# EAGLE design rf_board (EAGLE 7.2.0)
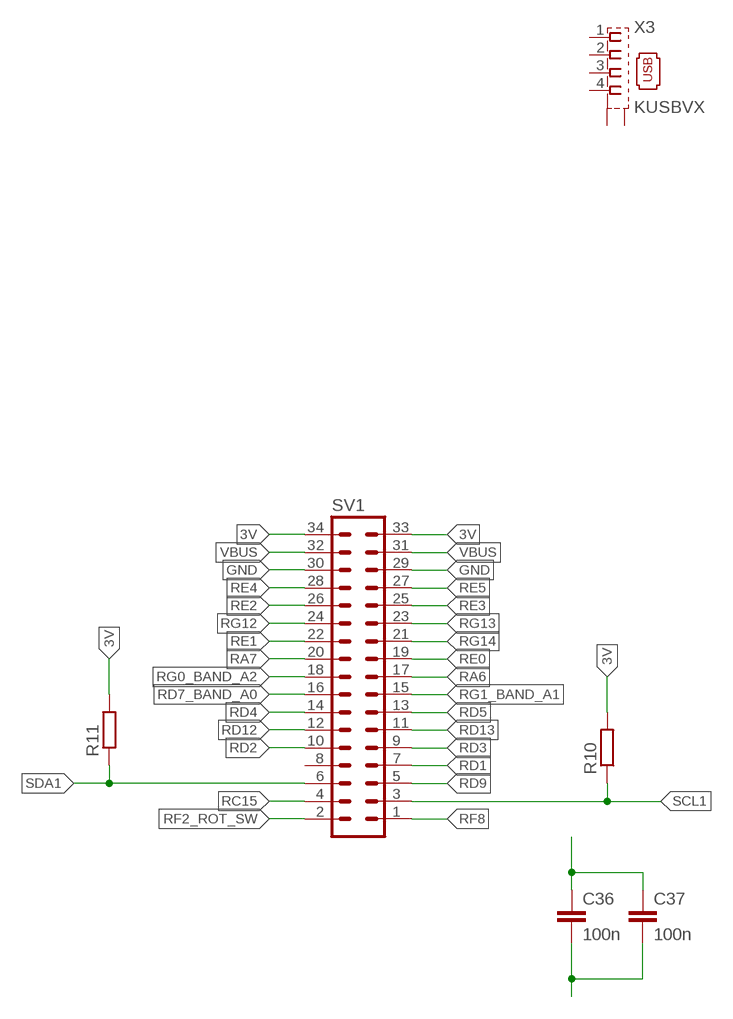
[diagram p0: schematic, sheet 1, part 1 of 2]
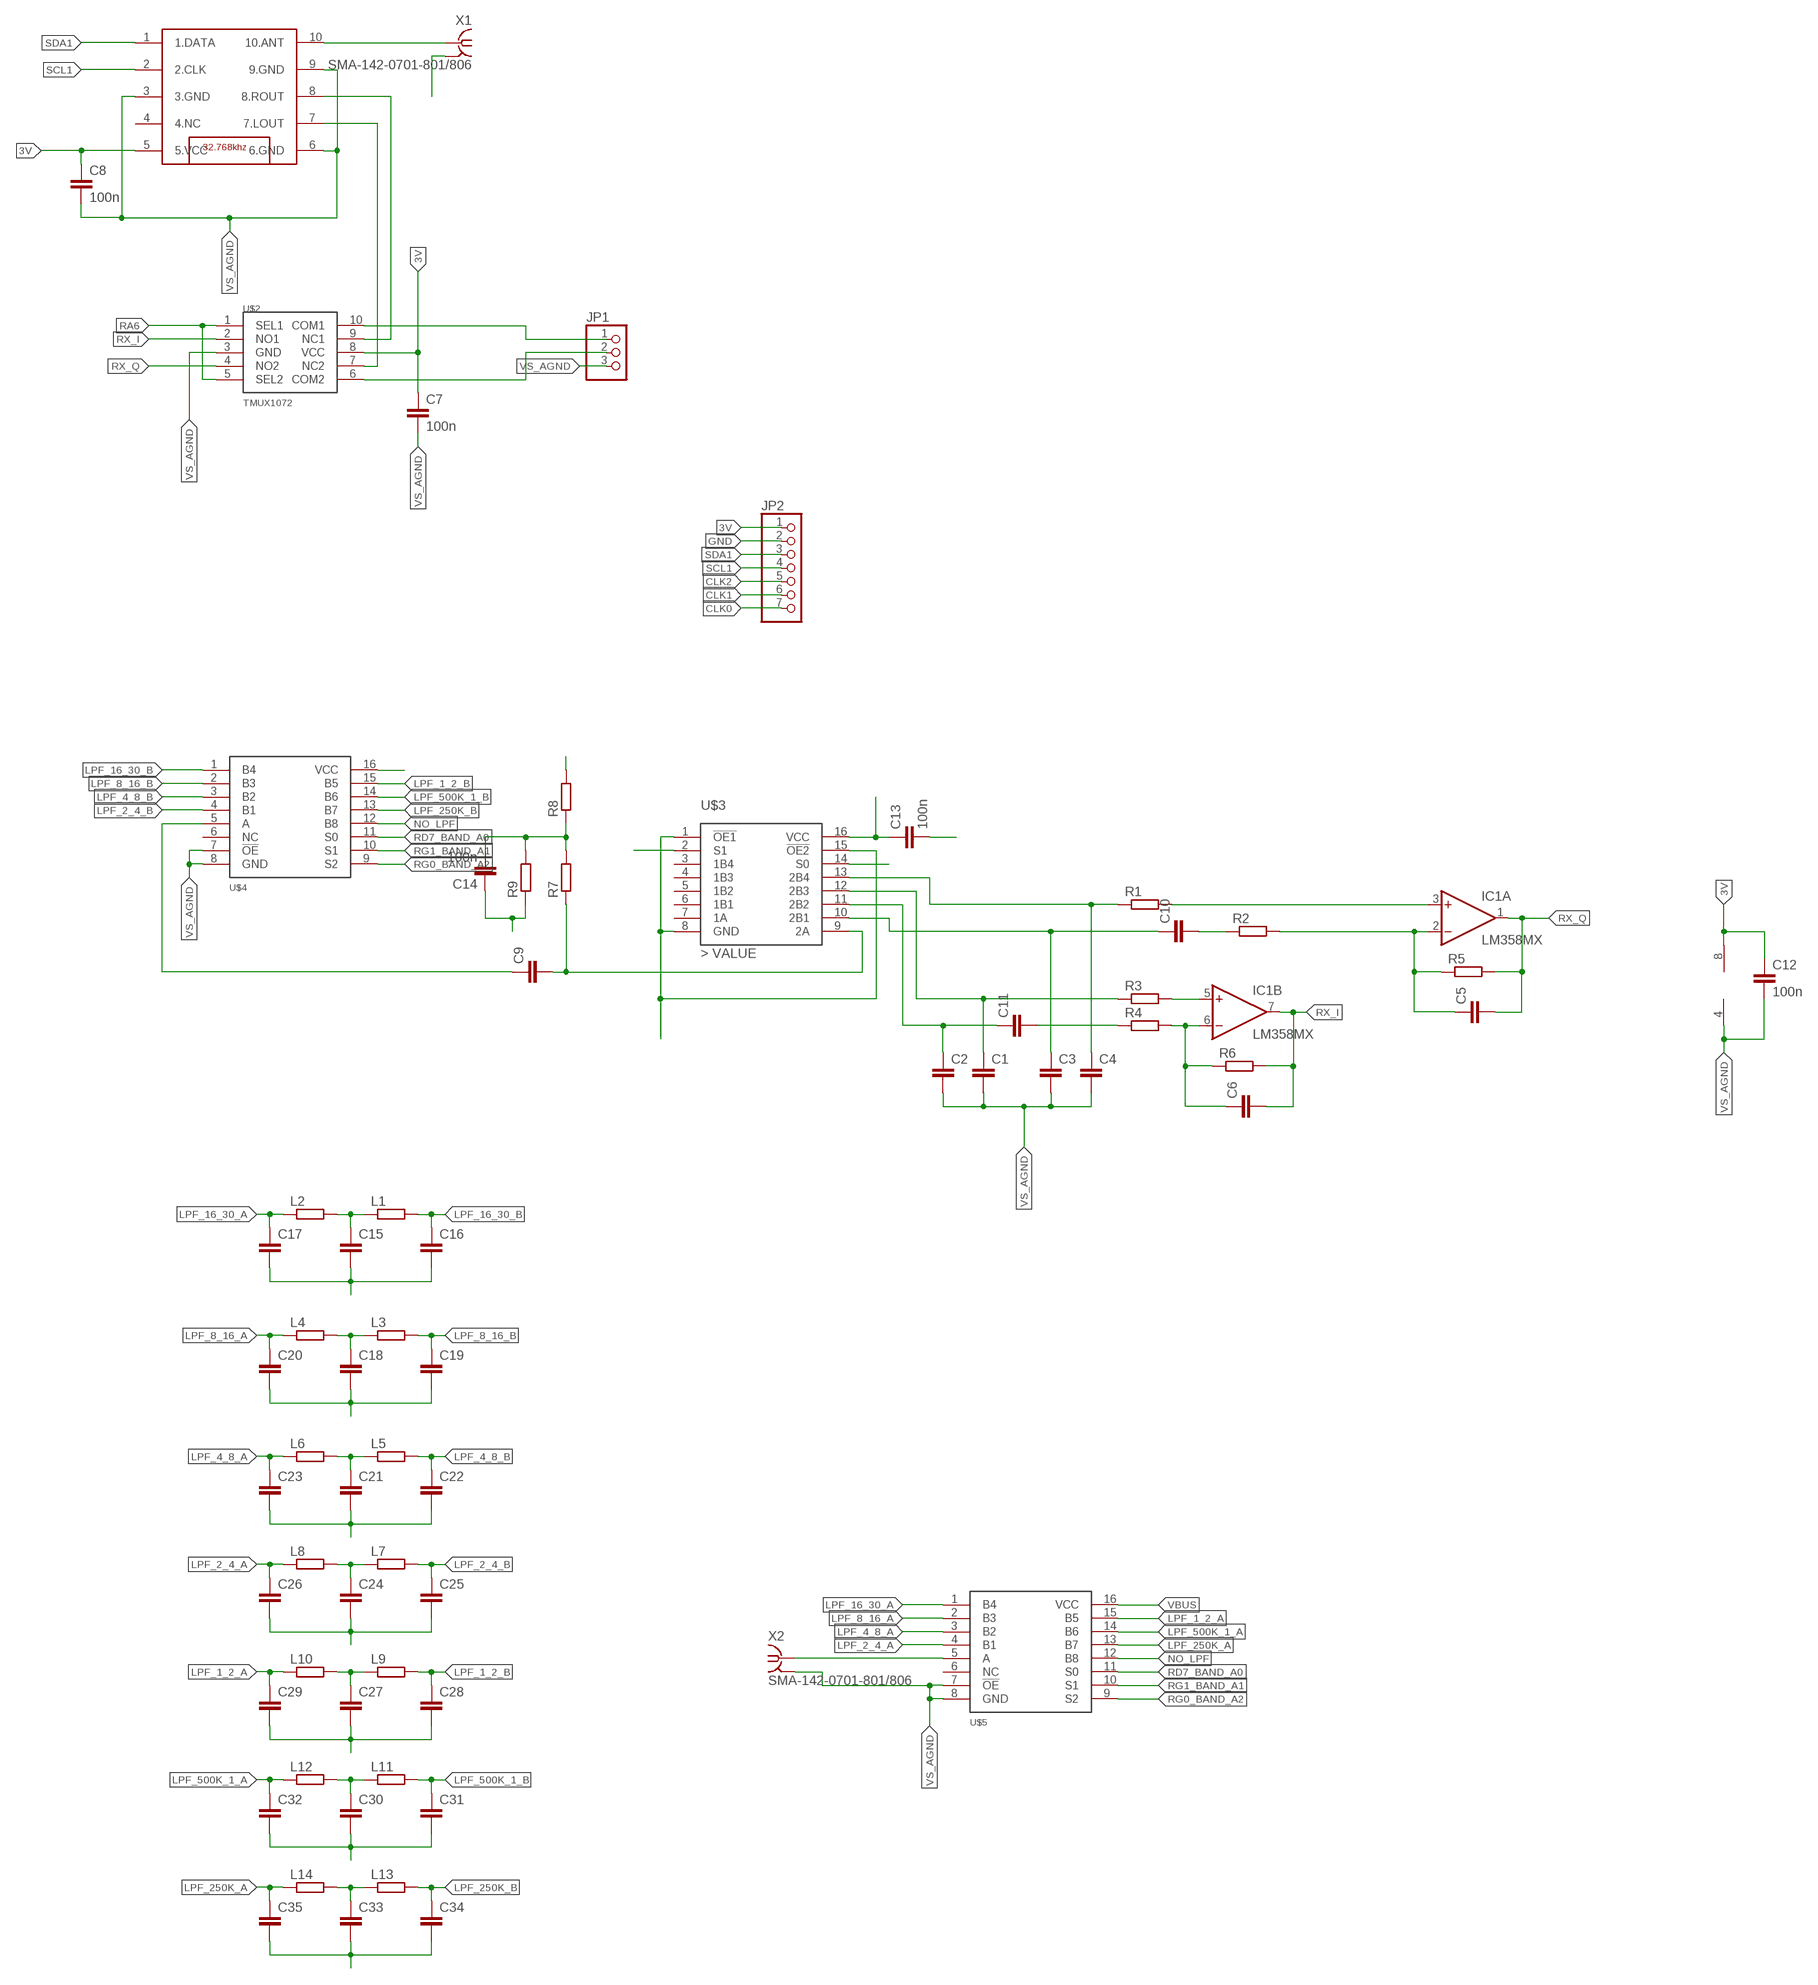
[diagram p1: schematic, sheet 1, part 2 of 2]

## Parts
C1  C-EUC0603  [C0603]
C2  C-EUC0603  [C0603]
C3  C-EUC0603  [C0603]
C4  C-EUC0603  [C0603]
C5  C-EUC0603  [C0603]
C6  C-EUC0603  [C0603]
C7  100n  C-EUC1206  [C1206]
C8  100n  C-EUC0603  [C0603]
C9  C-EUC0603  [C0603]
C10  C-EUC0603  [C0603]
C11  C-EUC0603  [C0603]
C12  100n  C-EUC0603  [C0603]
C13  100n  C-EUC0603  [C0603]
C14  100n  C-EUC0603  [C0603]
C15  C-EUC0805  [C0805]
C16  C-EUC0805  [C0805]
C17  C-EUC0805  [C0805]
C18  C-EUC0805  [C0805]
C19  C-EUC0805  [C0805]
C20  C-EUC0805  [C0805]
C21  C-EUC0805  [C0805]
C22  C-EUC0805  [C0805]
C23  C-EUC0805  [C0805]
C24  C-EUC0805  [C0805]
C25  C-EUC0805  [C0805]
C26  C-EUC0805  [C0805]
C27  C-EUC0805  [C0805]
C28  C-EUC0805  [C0805]
C29  C-EUC0805  [C0805]
C30  C-EUC0805  [C0805]
C31  C-EUC0805  [C0805]
C32  C-EUC0805  [C0805]
C33  C-EUC0805  [C0805]
C34  C-EUC0805  [C0805]
C35  C-EUC0805  [C0805]
C36  100n  C-EUC0603  [C0603]
C37  100n  C-EUC0603  [C0603]
IC1  LM358MX  [SO08]
JP1  PINHD-1X3  [1X03]
JP2  PINHD-1X7  [1X07]
L1  R-EU_R0805  [R0805]
L2  R-EU_R0805  [R0805]
L3  R-EU_R0805  [R0805]
L4  R-EU_R0805  [R0805]
L5  R-EU_R0805  [R0805]
L6  R-EU_R0805  [R0805]
L7  R-EU_R0805  [R0805]
L8  R-EU_R0805  [R0805]
L9  R-EU_R0805  [R0805]
L10  R-EU_R0805  [R0805]
L11  R-EU_R0805  [R0805]
L12  R-EU_R0805  [R0805]
L13  R-EU_R0805  [R0805]
L14  R-EU_R0805  [R0805]
R1  R-EU_R0603  [R0603]
R2  R-EU_R0603  [R0603]
R3  R-EU_R0603  [R0603]
R4  R-EU_R0603  [R0603]
R5  R-EU_R0603  [R0603]
R6  R-EU_R0603  [R0603]
R7  R-EU_0204/5  [0204/5]
R8  R-EU_R0603  [R0603]
R9  R-EU_R0603  [R0603]
R10  R-EU_0204/7  [0204/7]
R11  R-EU_0204/5  [0204/5]
SV1  ML34L  [ML34L]
U$1  TEA5767  [TJ-102BC]
U$2  TMUX1072  [TSSOP8]
U$3  FST3253SO16  [SO16]
U$4  SN74CBT3251  [TSSOP16]
U$5  SN74CBT3251  [TSSOP16]
X1  SMA-142-0701-801/806  [J502-ND-142-0701-801/806]
X2  SMA-142-0701-801/806  [J502-ND-142-0701-801/806]
X3  KUSBVX  [KUSBVX]

## Nets
3V: C7.1 C8.1 C12.1 C13.1 IC1.8(P:V+) JP2.1 R8.2 R10.2 R11.2 SV1.33 SV1.34 U$1.5(5.VCC) U$2.8(VCC) U$3.16(VCC)
CLK0: JP2.7 U$3.14(S0)
CLK1: JP2.6 U$3.2(S1)
CLK2: JP2.5
GND: JP2.2 SV1.29 SV1.30
IN_LEFT: JP1.2 U$2.6(COM2)
IN_RIGHT: JP1.1 U$2.10(COM1)
LPF_1_2_A: C29.1 L10.1 U$5.15(B5)
LPF_1_2_B: C28.1 L9.2 U$4.15(B5)
LPF_2_4_A: C26.1 L8.1 U$5.4(B1)
LPF_2_4_B: C25.1 L7.2 U$4.4(B1)
LPF_4_8_A: C23.1 L6.1 U$5.3(B2)
LPF_4_8_B: C22.1 L5.2 U$4.3(B2)
LPF_8_16_A: C20.1 L4.1 U$5.2(B3)
LPF_8_16_B: C19.1 L3.2 U$4.2(B3)
LPF_16_30_A: C17.1 L2.1 U$5.1(B4)
LPF_16_30_B: C16.1 L1.2 U$4.1(B4)
LPF_250K_A: C35.1 L14.1 U$5.13(B7)
LPF_250K_B: C34.1 L13.2 U$4.13(B7)
LPF_500K_1_A: C32.1 L12.1 U$5.14(B6)
LPF_500K_1_B: C31.1 L11.2 U$4.14(B6)
N$1: IC1.3(A:+IN) R1.2
N$2: C3.1 C10.1 U$3.10(2B1)
N$3: C4.1 R1.1 U$3.13(2B4)
N$4: C1.1 R3.1 U$3.12(2B3)
N$5: C2.1 C11.1 U$3.11(2B2)
N$6: C5.1 IC1.2(A:-IN) R2.2 R5.1
N$7: IC1.5(B:+IN) R3.2
N$10: C6.1 IC1.6(B:-IN) R4.2 R6.1
N$13: C9.2 R7.1 U$3.9(2A)
N$14: U$1.8(8.ROUT) U$2.9(NC1)
N$15: U$1.7(7.LOUT) U$2.7(NC2)
N$16: C10.2 R2.1
N$17: C11.2 R4.1
N$18: C14.2 R7.2 R8.1 R9.2
N$19: C15.1 L1.1 L2.2
N$20: U$5.5(A) X2.1
N$21: U$1.10(10.ANT) X1.1
N$22: C18.1 L3.1 L4.2
N$25: C21.1 L5.1 L6.2
N$28: C24.1 L7.1 L8.2
N$31: C27.1 L9.1 L10.2
N$34: C30.1 L11.1 L12.2
N$38: C33.1 L13.1 L14.2
N$41: C9.1 U$4.5(A)
NO_LPF: U$4.12(B8) U$5.12(B8)
RA6: SV1.17 U$2.1(SEL1) U$2.5(SEL2)
RA7: SV1.20
RC15: SV1.4
RD1: SV1.7
RD2: SV1.10
RD3: SV1.9
RD4: SV1.14
RD5: SV1.13
RD7_BAND_A0: SV1.16 U$4.11(S0) U$5.11(S0)
RD9: SV1.5
RD12: SV1.12
RD13: SV1.11
RE0: SV1.19
RE1: SV1.22
RE2: SV1.26
RE3: SV1.25
RE4: SV1.28
RE5: SV1.27
RF2_ROT_SW: SV1.2
RF8: SV1.1
RG0_BAND_A2: SV1.18 U$4.9(S2) U$5.9(S2)
RG1_BAND_A1: SV1.15 U$4.10(S1) U$5.10(S1)
RG12: SV1.24
RG13: SV1.23
RG14: SV1.21
RX_I: C6.2 IC1.7(B:OUT) R6.2 U$2.2(NO1)
RX_Q: C5.2 IC1.1(A:OUT) R5.2 U$2.4(NO2)
SCL1: JP2.4 R10.1 SV1.3 U$1.2(2.CLK)
SDA1: JP2.3 R11.1 SV1.6 U$1.1(1.DATA)
VBUS: C36.1 C37.1 SV1.31 SV1.32 U$4.16(VCC) U$5.16(VCC)
VS_AGND: C1.2 C2.2 C3.2 C4.2 C7.2 C8.2 C12.2 C13.2 C14.1 C15.2 C16.2 C17.2 C18.2 C19.2 C20.2 C21.2 C22.2 C23.2 C24.2 C25.2 C26.2 C27.2 C28.2 C29.2 C30.2 C31.2 C32.2 C33.2 C34.2 C35.2 C36.2 C37.2 IC1.4(P:V-) JP1.3 R9.1 U$1.3(3.GND) U$1.6(6.GND) U$1.9(9.GND) U$2.3(GND) U$3.1(!OE1) U$3.8(GND) U$3.15(!OE2) U$4.7(!OE) U$4.8(GND) U$5.7(!OE) U$5.8(GND) X1.G@1 X1.G@2 X1.G@3 X1.G@4 X2.G@1 X2.G@2 X2.G@3 X2.G@4
Unconnected: SV1.8 U$1.4(4.NC) U$3.3(1B4) U$3.4(1B3) U$3.5(1B2) U$3.6(1B1) U$3.7(1A) U$4.6(NC) U$5.6(NC) X3.1 X3.2 X3.3 X3.4 X3.M1(S1) X3.M2(S2)

## Library data of the parts
C1-C37 = rcl:C-EU: CAPACITOR, European symbol
IC1 = linear:LM358: OP AMP also LM158; LM258; LM2904 Source: http://cache.national.com/ds/LM/LM158.pdf
JP1 = pinhead:PINHD-1X3: PIN HEADER
JP2 = pinhead:PINHD-1X7: PIN HEADER
L1-L14 R1-R11 = rcl:R-EU_: RESISTOR, European symbol
SV1 = con-harting-ml:ML34: HARTING; OC_FARNELL: unknown; OC_NEWARK: unknown
U$1 = TEA5767:TEA5767
U$2 = mw:TMUX1072
U$3 = mw:FST3253
U$4 U$5 = mw:SN74CBT3251
X1 X2 = con-coax:SMA-: SMA 50 Ohm End Launch Jack Receptacle - Round Contact Johnson Components Source: www.johnsoncomponents.com .. J502-ND.pdf; MF: JOHNSON COMPONENTS; MPN: 142-0701-801; OC_FARNELL: 1608592; OC_NEWARK: 90F2624
X3 = con-kycon:KUSBVX: Vertical,Top Entry Universal Serial Bus Connector KUSBVX Series Source: KYCON Sibalco USB vertical socket KUSBV.pdf

## Board
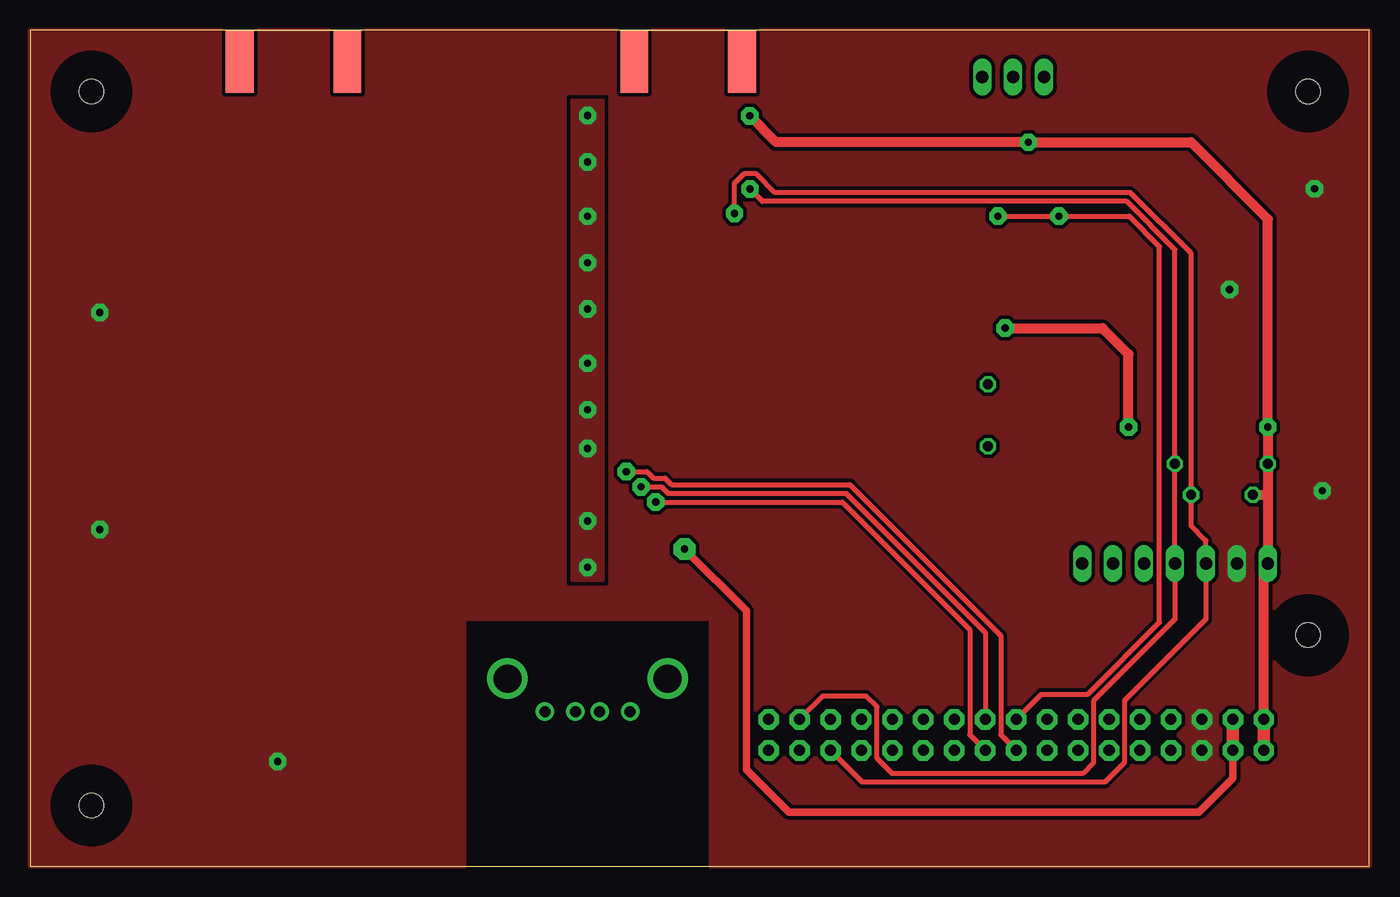
[diagram p2: board, top side]
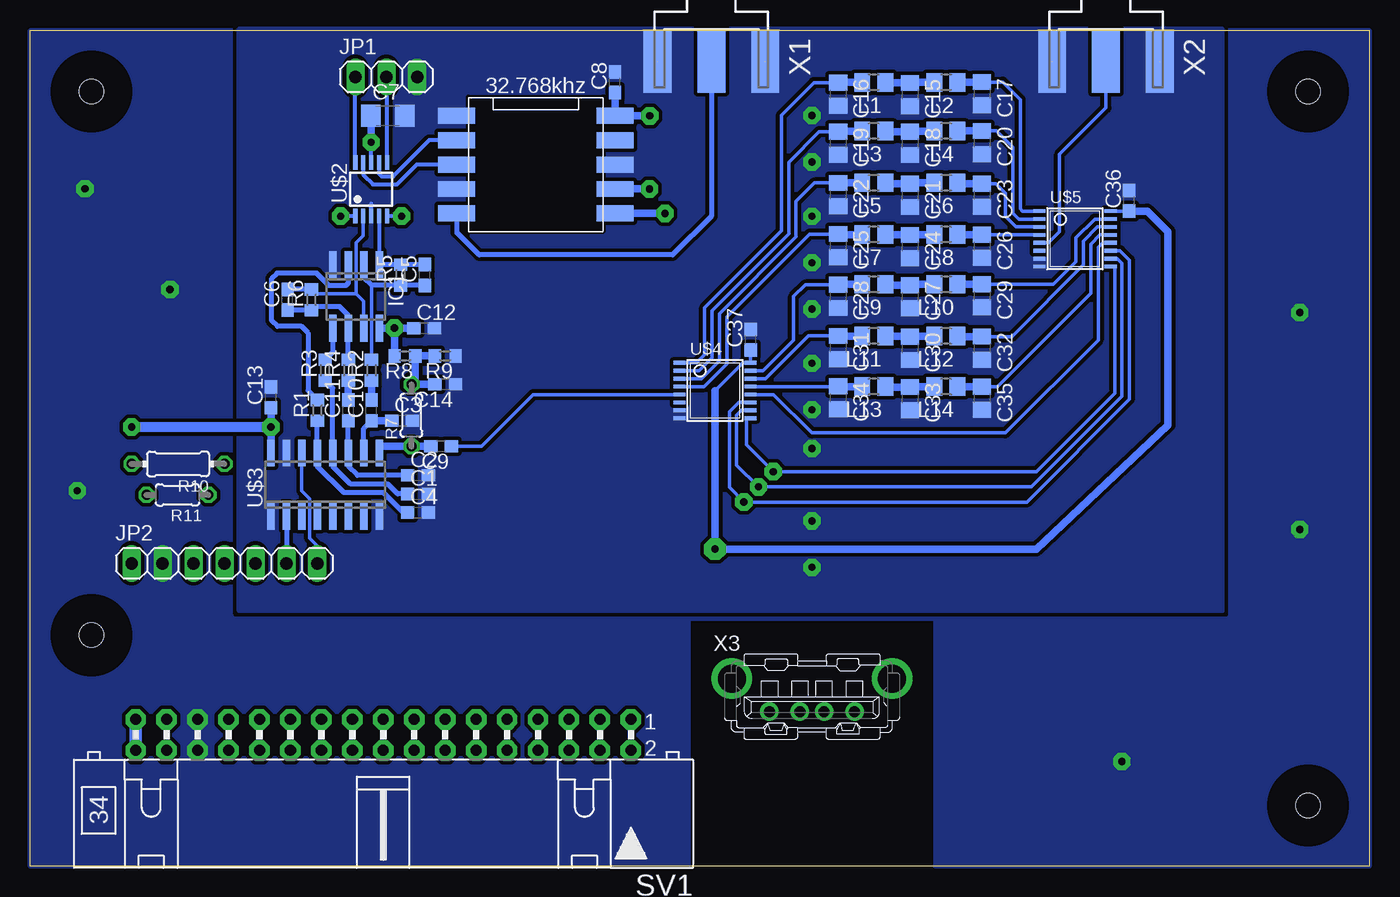
[diagram p3: board, bottom side, seen from below]

Size 109.86 x 68.58 mm. Coordinates in mm from the lower left corner, seen from the top.
Outline: 0,0 109.86,0 109.86,68.58 0,68.58 0,0
Copper layers (1*16): Top 0.035mm / dielectric 1.5mm / Bottom 0.035mm
Design rules "default *": minimum track width 10mil, minimum drill 24mil, track to track 8mil, track to pad 8mil, pad to pad 8mil, via to via 8mil, smd to smd 8mil, copper to edge 0mil, drill to drill 8mil, minimum pad ring 10mil, minimum via ring 8mil, stop-mask expansion 4mil, vias tented up to drill 0mil, thermal gap 10mil
Holes 2 mm at 5,5 104.86,18.97 104.86,63.58 5,63.58
tRestrict: area 2,2 to 8,8; area 101.8,15.9 to 107.9,22; area 101.8,60.5 to 107.9,66.6; area 2,60.5 to 8,66.6
bRestrict: area 2,2 to 8,8; area 101.8,15.9 to 107.9,22; area 101.8,60.5 to 107.9,66.6; area 2,60.5 to 8,66.6

### Footprints (pad centres in the part's own frame; a part is rotated, then mirrored left to right if it is on the bottom)
C0603 = smd 1.1 x 1: 1 -0.85,0; 2 0.85,0
C1206 = smd 1.6 x 1.8: 1 -1.4,0; 2 1.4,0
C0805 = smd 1.3 x 1.5: 1 -0.95,0; 2 0.95,0
SO08 = smd 0.6 x 2.2: 1 -1.905,-2.6; 2 -0.635,-2.6; 3 0.635,-2.6; 4 1.905,-2.6; 5 1.905,2.6; 6 0.635,2.6; 7 -0.635,2.6; 8 -1.905,2.6
1X03 = drill 1.016 long: 1 -2.54,0; 2 0,0; 3 2.54,0
1X07 = drill 1.016 long: 1 -7.62,0; 2 -5.08,0; 3 -2.54,0; 4 0,0; 5 2.54,0; 6 5.08,0; 7 7.62,0
R0805 = smd 1.3 x 1.5: 1 -0.95,0; 2 0.95,0
R0603 = smd 1 x 1.1: 1 -0.85,0; 2 0.85,0
0204/5 = drill 0.813 octagon: 1 -2.54,0; 2 2.54,0
0204/7 = drill 0.813 octagon: 1 -3.81,0; 2 3.81,0
ML34L = drill 0.914 pad 1.676 octagon: 1 -20.32,-1.27; 2 -20.32,1.27; 3 -17.78,-1.27; 4 -17.78,1.27; 5 -15.24,-1.27; 6 -15.24,1.27; 7 -12.7,-1.27; 8 -12.7,1.27; 9 -10.16,-1.27; 10 -10.16,1.27; 11 -7.62,-1.27; 12 -7.62,1.27; 13 -5.08,-1.27; 14 -5.08,1.27; 15 -2.54,-1.27; 16 -2.54,1.27; 17 0,-1.27; 18 0,1.27; 19 2.54,-1.27; 20 2.54,1.27; 21 5.08,-1.27; 22 5.08,1.27; 23 7.62,-1.27; 24 7.62,1.27; 25 10.16,-1.27; 26 10.16,1.27; 27 12.7,-1.27; 28 12.7,1.27; 29 15.24,-1.27; 30 15.24,1.27; 31 17.78,-1.27; 32 17.78,1.27; 33 20.32,-1.27; 34 20.32,1.27
TJ-102BC = smd 3 x 1.3: 1 -2,0.5; 2 -2,-1.5; 3 -2,-3.5; 4 -2,-5.5; 5 -2,-7.5; 6 11,-7.5; 7 11,-5.5; 8 11,-3.5; 9 11,-1.5; 10 11,0.5
TSSOP8 = smd 1.2 x 0.35: 1 -2,0.975; 2 -2,0.325; 3 -2,-0.325; 4 -2,-0.975; 5 -2,-1.625; 6 2.4,-1.625; 7 2.4,-0.975; 8 2.4,-0.325; 9 2.4,0.325; 10 2.4,0.975
SO16 = smd 0.6 x 2.2: 1 -4.445,-2.6; 2 -3.175,-2.6; 3 -1.905,-2.6; 4 -0.635,-2.6; 5 0.635,-2.6; 6 1.905,-2.6; 7 3.175,-2.6; 8 4.445,-2.6; 9 4.445,2.6; 10 3.175,2.6; 11 1.905,2.6; 12 0.635,2.6; 13 -0.635,2.6; 14 -1.905,2.6; 15 -3.175,2.6; 16 -4.445,2.6
TSSOP16 = smd 0.305 x 0.991: 1 -2.275,-2.918; 2 -1.625,-2.918; 3 -0.975,-2.918; 4 -0.325,-2.918; 5 0.325,-2.918; 6 0.975,-2.918; 7 1.625,-2.918; 8 2.275,-2.918; 9 2.275,2.918; 10 1.625,2.918; 11 0.975,2.918; 12 0.325,2.918; 13 -0.325,2.918; 14 -0.975,2.918; 15 -1.625,2.918; 16 -2.275,2.918
J502-ND-142-0701-801/806 = smd 5.08 x 2.286: 1 2.565,0; G@1 2.565,4.42; G@2 2.565,-4.42 | smd 5.08 x 2.286 bottom: G@3 2.565,4.42; G@4 2.565,-4.42
KUSBVX = drill 0.9 pad 1.524: 1 3.5,0; 2 1,0; 3 -1,0; 4 -3.5,0 | drill 2.3 pad 2.8: M1 -6.57,2.71; M2 6.57,2.71

### Placement (x,y rotation side)
C1  78.05,30.56 0 bottom
C2  78.05,32.08 0 bottom
C3  79.36,36.56 0 bottom
C4  78.05,29.03 0 bottom
C5  77.5,48.51 90 bottom
C6  88.75,46.48 90 bottom
C7  80.52,61.6 0 bottom
C8  61.88,64.34 90 bottom
C9  76.15,34.47 180 bottom
C10  81.86,37.41 90 bottom
C11  83.77,37.41 90 bottom
C12  77.55,44.16 0 bottom
C13  90.12,38.48 90 bottom
C14  75.82,39.55 180 bottom
C15  37.68,63.32 270 bottom
C16  43.57,63.35 270 bottom
C17  31.77,63.4 270 bottom
C18  37.68,59.31 270 bottom
C19  43.57,59.33 270 bottom
C20  31.77,59.39 270 bottom
C21  37.68,55.04 270 bottom
C22  43.57,55.12 270 bottom
C23  31.77,55.07 270 bottom
C24  37.68,50.85 270 bottom
C25  43.57,50.93 270 bottom
C26  31.77,50.88 270 bottom
C27  37.68,46.74 270 bottom
C28  43.57,46.76 270 bottom
C29  31.77,46.81 270 bottom
C30  37.68,42.49 270 bottom
C31  43.57,42.57 270 bottom
C32  31.77,42.52 270 bottom
C33  37.68,38.38 270 bottom
C34  43.57,38.46 270 bottom
C35  31.77,38.4 270 bottom
C36  19.68,54.61 90 bottom
C37  50.75,43.21 90 bottom
IC1  83.13,46.76 180 bottom
JP1  80.64,64.77 0 bottom
JP2  93.93,24.87 0 bottom
L1  40.64,64.31 180 bottom
L2  34.72,64.31 180 bottom
L3  40.64,60.33 180 bottom
L4  34.72,60.33 180 bottom
L5  40.64,56.08 180 bottom
L6  34.72,56.08 180 bottom
L7  40.64,51.84 180 bottom
L8  34.72,51.84 180 bottom
L9  40.64,47.75 180 bottom
L10  34.72,47.75 180 bottom
L11  40.64,43.51 180 bottom
L12  34.72,43.51 180 bottom
L13  40.64,39.37 180 bottom
L14  34.72,39.37 180 bottom
R1  86.31,37.41 90 bottom
R2  81.86,40.72 90 bottom
R3  85.67,40.72 90 bottom
R4  83.77,40.72 90 bottom
R5  79.48,48.51 90 bottom
R6  86.79,46.48 90 bottom
R7  78.59,37.01 90 bottom
R8  79.12,41.88 180 bottom
R9  75.82,41.88 180 bottom
R10  97.74,33.02 180 bottom
R11  97.79,30.48 180 bottom
SV1  80.9,10.79 180 bottom
U$1  63.88,54.08 180 bottom
U$2  82.22,55.35 90 bottom
U$3  85.67,31.32 0 bottom
U$4  53.67,39.04 270 bottom
U$5  24.13,51.49 270 bottom
X1  53.98,68.58 270 bottom
X2  21.59,68.58 270 bottom
X3  45.72,12.7 0 bottom

### Tracks (layer width: path | path; a pad name or v marks a point on that pad's centre or on a via)
3V  (via drill 0.6 pad 1.42)
  Top 0.813: v59.03,61.58 61.2,59.41 v81.89,59.41 95.25,59.41 101.55,53.11 v101.55,36.04 R10.2 101.55,30.48 | v90.12,36.04 90.12,42.01 | 90.12,42.01 90.12,42.05 | v79.99,44.16 87.97,44.16 90.12,42.01 | SV1.33 101.22,24.54 JP2.1 101.55,30.48 | R11.2 101.55,30.48
  Top 1.016: SV1.34 SV1.33
  Bottom 0.348: U$2.8 v81.89,59.41
  Bottom 0.61: v59.03,61.58 U$1.5 C8.1 | v79.99,44.16 IC1.8 | U$3.16 v90.12,36.04 C13.1 | C12.1 v79.99,44.16 | C7.1 81.89,61.58 v81.89,59.41 | v79.99,44.16 79.99,41.9 R8.2
  Bottom 0.813: JP2.1 101.55,24.43 | v90.12,36.04 v101.55,36.04
  Bottom 1.016: SV1.33 101.22,9.55
CLK0
  Bottom 0.305: U$3.14 87.58,30.81 86.94,30.18 86.94,26.92 86.31,26.29 JP2.7
CLK1
  Bottom 0.406: U$3.2 JP2.6
GND  (via drill 0.6 pad 1.42)
  other vias: 5.69,27.65 5.69,45.43 20.29,8.6 105.38,55.59 106.02,30.83 98.4,47.34
  pour Top (isolate 0.305, rank 2, no thermals): 0,0 0,68.58 109.86,68.58 109.86,0 55.88,0 55.88,20.32 35.56,20.32 35.56,0
  pour Bottom (isolate 0.305, rank 2, no thermals): 0,68.58 0,0 35.56,0 35.56,20.32 55.88,20.32 55.88,0 109.86,0 109.86,68.58
IN_LEFT
  Bottom 0.348: U$2.6 80.59,64.72 JP1.2
IN_RIGHT
  Bottom 0.348: U$2.10 JP1.1
LPF_1_2_A
  Bottom 0.305: C29.1 25.9,47.76 24.05,49.61 24.05,51.56 22.5,53.11 U$5.15
  Bottom 0.61: C29.1 33.76,47.76 L10.1
LPF_1_2_B
  Bottom 0.305: U$4.15 49.73,40.66 47.22,43.18 47.22,46.76 46.27,47.71 C28.1
  Bottom 0.61: L9.2 43.53,47.75 C28.1
LPF_2_4_A
  Bottom 0.305: U$5.4 31.75,51.81 C26.1
  Bottom 0.61: C26.1 33.76,51.83 L8.1
LPF_2_4_B
  Bottom 0.305: C25.1 45.91,51.88 52.7,45.09 52.7,41.22 54.56,39.37 U$4.4
  Bottom 0.61: L7.2 43.54,51.84 C25.1
LPF_4_8_A
  Bottom 0.305: U$5.3 28.97,52.46 29.84,53.34 29.84,55.24 30.62,56.02 C23.1
  Bottom 0.61: C23.1 33.71,56.02 L6.1
LPF_4_8_B
  Bottom 0.305: C22.1 45.53,56.07 47.02,54.59 47.02,51.64 53.31,45.34 53.31,41.48 54.78,40.02 U$4.3
  Bottom 0.61: L5.2 43.56,56.08 C22.1
LPF_8_16_A
  Bottom 0.305: U$5.2 28.75,53.11 29.23,53.59 29.23,59 30.57,60.34 C20.1
  Bottom 0.61: C20.1 L4.1
LPF_8_16_B
  Bottom 0.305: C19.1 45.13,60.28 47.62,57.78 47.62,51.89 53.92,45.59 53.92,41.73 54.99,40.66 U$4.2
  Bottom 0.61: L3.2 43.53,60.33 C19.1
LPF_16_30_A
  Bottom 0.305: U$5.1 28.44,53.76 28.63,53.95 28.63,62.92 30.06,64.35 C17.1
  Bottom 0.61: L2.1 31.8,64.31 C17.1
LPF_16_30_B
  Bottom 0.305: U$4.1 55.2,41.31 54.53,41.99 54.53,45.85 48.23,52.15 48.23,61.62 45.56,64.3 C16.1
  Bottom 0.61: L1.2 43.56,64.31 C16.1
LPF_250K_A
  Bottom 0.305: C35.1 30.5,39.35 22.84,47.02 22.84,51.05 22.08,51.81 U$5.13
  Bottom 0.61: C35.1 33.76,39.35 L14.1
LPF_250K_B
  Bottom 0.305: U$4.13 43.61,39.37 C34.1
  Bottom 0.61: L13.2 43.54,39.37 C34.1
LPF_500K_1_A
  Bottom 0.305: U$5.14 22.29,52.46 23.44,51.31 23.44,49.35 29.33,43.47 C32.1
  Bottom 0.61: C32.1 33.73,43.47 L12.1
LPF_500K_1_B
  Bottom 0.305: C31.1 46.02,43.52 49.52,40.02 U$4.14
  Bottom 0.61: L11.2 C31.1
N$1
  Bottom 0.406: IC1.3 83.77,47.85 83.97,47.65 85.34,47.65 86.36,48.67 89.61,48.67 90.04,48.23 90.04,44.76 89.59,44.3 87.61,44.3 87.07,43.76 87.07,39.03 R1.2
N$2
  Bottom 0.406: U$3.10 82.5,35.93 C10.1
  Bottom 0.61: C3.1 C10.1
N$3
  Bottom 0.406: R1.1 U$3.13 86.31,32.84 84.12,30.66 80.87,30.66 79.25,29.03 C4.1
N$4
  Bottom 0.406: R3.1 85.04,39.23 U$3.12 85.04,32.84 83.57,31.37 80.52,31.37 79.7,30.56 C1.1
N$5
  Bottom 0.406: C11.1 U$3.11 83.77,32.84 83.01,32.08 C2.1
N$6
  Bottom 0.305: R2.2 81.86,47.65 81.85,47.66
  Bottom 0.406: IC1.2 82.5,48.31 81.85,47.66 R5.1 C5.1
N$7
  Bottom 0.406: IC1.5 85.04,42.2 R3.2
N$8  (via drill 0.6 pad 1.27)
  other vias: 104.86,18.97
N$9  (via drill 0.6 pad 1.27)
  other vias: 104.86,63.58
N$10
  Bottom 0.406: C6.1 R6.1 86.5,45.92 84.48,45.92 83.77,45.21 IC1.6 R4.2
N$11  (via drill 0.6 pad 1.27)
  other vias: 5,63.58
N$12
  cutout Bottom: 73.91,63.12 62.87,63.12 62.87,52.07 73.91,52.07
N$13
  Bottom 0.406: 81.23,34.47 U$3.9
  Bottom 0.61: C9.2 R7.1 81.23,34.47
N$14
  Bottom 0.348: U$2.9 82.55,56.76 81.74,55.96 79.78,55.96 78.16,57.58 U$1.8
N$15
  Bottom 0.348: U$2.7 81.25,56.84 81.03,56.62 80.09,56.62 77.13,59.58 U$1.7
N$16
  Bottom 0.61: C10.2 R2.1
N$17
  Bottom 0.61: C11.2 R4.1
N$18
  Bottom 0.61: C14.2 R7.2 78.27,39.86 R8.1 R9.2
N$19
  Bottom 0.61: L2.2 37.64,64.31 C15.1 39.65,64.27 L1.1
N$20
  Bottom 0.305: U$5.5 26.31,51.16 25.4,52.07 25.4,58.42 21.59,62.23 X2.1
N$21
  Bottom 0.406: X1.1 53.98,53.34 57.15,50.16 73.03,50.16 74.88,52.02 U$1.10
N$22
  Bottom 0.61: L4.2 37.61,60.33 C18.1 39.62,60.26 L3.1
N$25
  Bottom 0.61: L6.2 37.59,56.08 C21.1 39.6,55.99 L5.1
N$28
  Bottom 0.61: L8.2 37.64,51.84 C24.1 39.65,51.8 L7.1
N$31
  Bottom 0.61: L10.2 37.61,47.75 C27.1 39.62,47.69 L9.1
N$34
  Bottom 0.61: L12.2 37.61,43.51 C30.1 37.74,43.51 L11.1
N$36  (via drill 0.6 pad 1.27)
  other vias: 5,5
N$38
  Bottom 0.61: L14.2 37.64,39.37 C33.1 39.65,39.33 L13.1
N$41
  Bottom 0.305: C9.1 72.85,34.47 68.6,38.72 U$4.5
NO_LPF
  Bottom 0.305: U$5.12 21.86,51.16 22.23,50.8 22.23,43.18 29.84,35.56 45.72,35.56 48.88,38.72 U$4.12
RA6  (via drill 0.6 pad 1.42)
  Top 0.406: v79.4,53.35 v84.4,53.35 90.16,53.35 92.66,50.85 92.66,20.02 86.77,14.12 82.96,14.12 SV1.17
  Bottom 0.348: U$2.1 v84.4,53.35 | v79.4,53.35 U$2.5
RD7_BAND_A0  (via drill 0.6 pad 1.42)
  Top 0.406: v51.31,29.9 66.62,29.9 77.09,19.43 77.09,10.79 SV1.16
  Bottom 0.305: U$5.11 20.44,50.51 19.66,49.73 19.66,38.33 28.09,29.9 v51.31,29.9 52.5,31.09 52.5,37.29 51.72,38.06 U$4.11
RG0_BAND_A2  (via drill 0.6 pad 1.42)
  Top 0.406: v48.9,32.38 50.6,32.38 51.13,31.85 52.09,31.85 52.63,31.32 67.23,31.32 79.63,18.92 79.63,10.79 SV1.18
  Bottom 0.305: U$5.9 20.88,49.21 20.88,38.81 27.3,32.38 v48.9,32.38 51.1,34.59 51.1,36.77 U$4.9
RG1_BAND_A1  (via drill 0.6 pad 1.42)
  Top 0.406: v50.11,31.14 51.79,31.14 52.32,30.61 66.93,30.61 78.36,19.18 SV1.15
  Bottom 0.305: U$5.10 20.65,49.86 20.27,49.48 20.27,38.58 27.71,31.14 v50.11,31.14 51.89,32.92 51.89,37.03 51.51,37.41 U$4.10
RX_I
  Bottom 0.305: IC1.7 82.5,46.35 83.13,46.99 83.13,47.09 | U$2.2 82.55,51.73 83.13,51.15 83.13,47.09 | R6.2 86.79,46.99 83.24,46.99 83.13,47.09
  Bottom 0.406: R6.2 C6.2
RX_Q
  Bottom 0.348: U$2.4 81.25,49.38 IC1.1
  Bottom 0.406: C5.2 R5.2 IC1.1
SCL1  (via drill 0.6 pad 1.42)
  Top 0.406: SV1.3 65.02,13.97 68.58,13.97 69.47,13.08 69.47,8.89 70.74,7.62 86.36,7.62 87.25,8.51 87.25,13.59 93.93,20.27 JP2.4 R10.1 93.93,50.6 89.97,54.56 60.07,54.56 v59.05,55.58
  Bottom 0.61: v59.05,55.58 U$1.2
SDA1  (via drill 0.6 pad 1.42)
  Top 0.406: SV1.6 68.28,6.91 88.19,6.91 89.79,8.51 89.79,13.59 96.47,20.27 JP2.3 96.47,26.72 95.25,27.94 R11.1 95.25,50.29 90.27,55.27 61.11,55.27 59.56,56.82 58.55,56.82 57.78,56.06 v57.78,53.58
  Bottom 0.61: v57.78,53.58 U$1.1
VBUS  (via drill 0.6 pad 1.78)
  Top 0.61: v53.67,26.04 58.75,20.95 58.75,7.92 62.23,4.45 95.89,4.45 98.68,7.24 SV1.32
  Top 1.016: SV1.32 SV1.31
  Bottom 0.305: U$5.16 C36.1 | C37.1 U$4.16 51.4,41.31 53.67,39.04
  Bottom 0.61: C36.1 18.2,53.76 16.51,52.07 16.51,36.2 27.3,26.04 v53.67,26.04 53.67,39.04
VS_AGND  (via drill 0.6 pad 1.42)  (4 unrouted)
  Bottom 0.348: U$2.3 81.89,54.38
  other vias: 45.72,37.47 45.72,34.29 45.72,41.27 45.72,45.72 45.72,49.53 45.72,53.34 45.72,57.78 45.72,61.59 45.72,28.35 45.72,24.54
  pour Bottom (isolate 0.305, no thermals): 12.06,68.71 12.06,20.95 92.71,20.95 92.71,68.71
  pour Top: 44.45,62.87 44.45,23.5 46.99,23.5 46.99,62.87